# EAGLE schematic space_charge_psu (EAGLE 7.2.0)
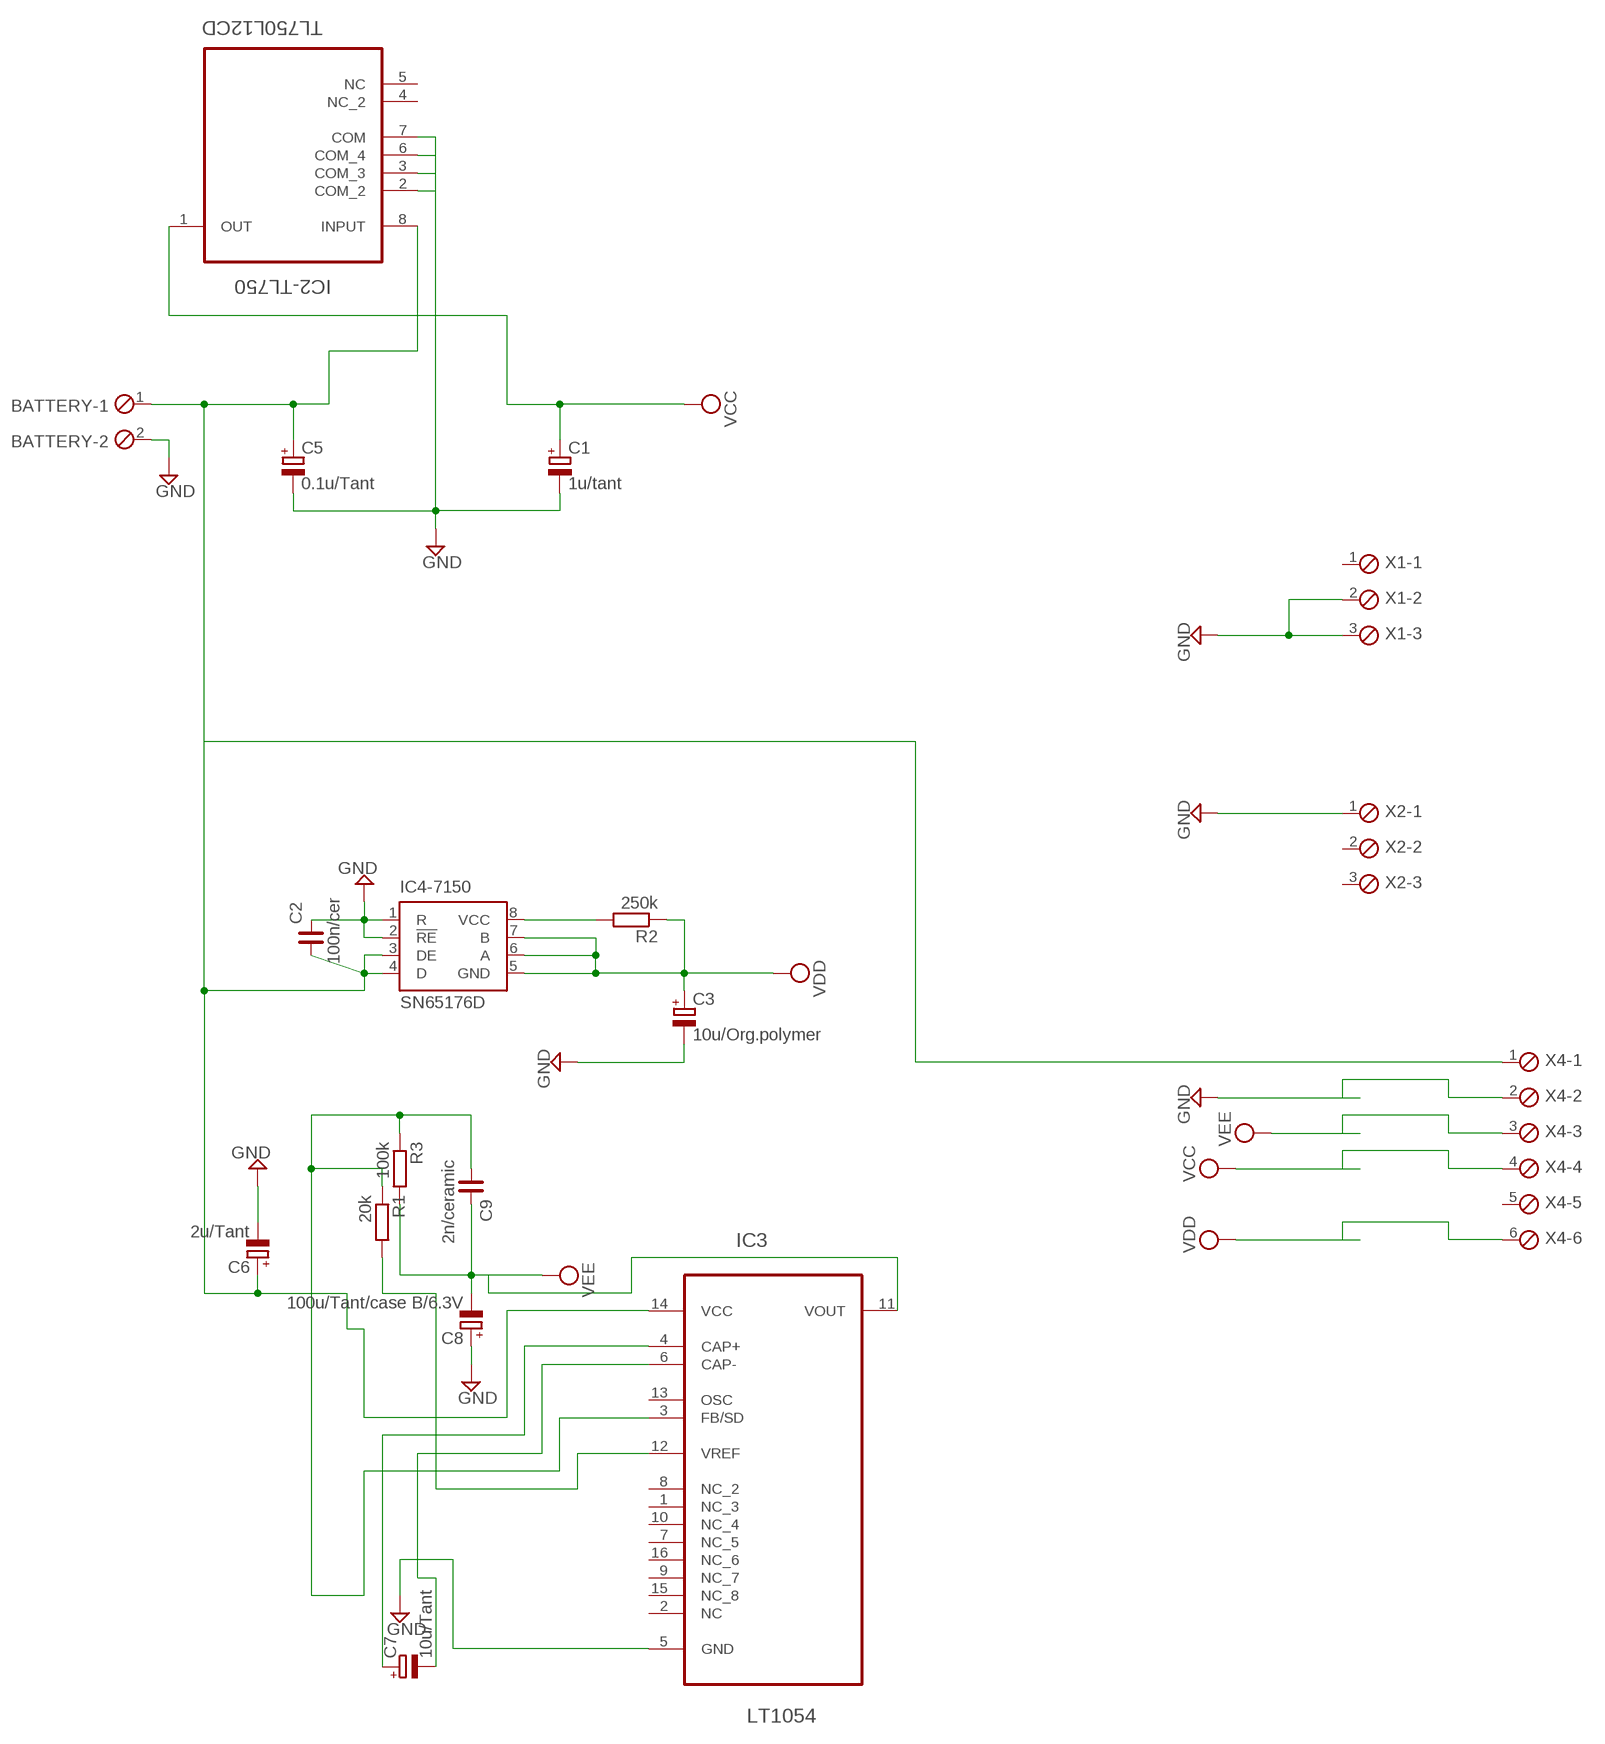
[diagram p0: schematic, sheet 1]

## Parts
BATTERY  MPT2  [2POL254]
C1  1u/tant  CPOL-EUA/3216-18R  [A/3216-18R]
C2  100n/cer  C_1206  [C1206]
C3  10u/Org.polymer  CPOL-EU153CLV-0505  [153CLV-0505]
C5  0.1u/Tant  CPOL-EUA/3216-18R  [A/3216-18R]
C6  2u/Tant  CPOL-EUA/3216-18R  [A/3216-18R]
C7  10u/Tant  CPOL-EUA/3216-18R  [A/3216-18R]
C8  100u/Tant/case B/6.3V  CPOL-EUB/3528-21R  [B/3528-21R]
C9  2n/ceramic  C_1206  [C1206]
IC2-TL750  TL750L12CD  [SOIC127P600X175-8N]
IC3  LT1054  LT1054CDW  [SOIC127P1030X265-16N]
IC4-7150  SN65176D  [SO-08]
R1  20k  R-EU_R1206  [R1206]
R2  250k  R-EU_R1206  [R1206]
R3  100k  R-EU_R1206  [R1206]
X1  MPT3  [3POL254]
X2  MPT3  [3POL254]
X4  MPT6  [6POL254]

## Nets
GND: BATTERY.2 C1.- C2.2 C3.- C5.- C6.- C8.+ IC2-TL750.2(COM_2) IC2-TL750.3(COM_3) IC2-TL750.6(COM_4) IC2-TL750.7(COM) IC3.5(GND) IC4-7150.1(R) IC4-7150.2(!RE) X1.2 X1.3 X2.1 X4.2
N$3: BATTERY.1 C2.1 C5.+ C6.+ IC2-TL750.8(INPUT) IC3.14(VCC) IC4-7150.3(DE) IC4-7150.4(D) X4.1
N$4: IC4-7150.8(VCC) R2.2
N$5: IC3.12(VREF) R1.2
N$6: C7.+ IC3.4(CAP+)
N$7: C7.- IC3.6(CAP-)
N$12: C9.1 IC3.3(FB/SD) R1.1 R3.1
VCC: C1.+ IC2-TL750.1(OUT) X4.4
VDD: C3.+ IC4-7150.5(GND) IC4-7150.6(A) IC4-7150.7(B) R2.1 X4.6
VEE: C8.- C9.2 IC3.11(VOUT) R3.2 X4.3
Unconnected: IC2-TL750.4(NC_2) IC2-TL750.5(NC) IC3.1(NC_3) IC3.2(NC) IC3.7(NC_5) IC3.8(NC_2) IC3.9(NC_7) IC3.10(NC_4) IC3.13(OSC) IC3.15(NC_8) IC3.16(NC_6) X1.1 X2.2 X2.3 X4.5

## Library data of the parts
BATTERY = con-phoenix-254:MPT2: PHOENIX CONNECTOR; OC_FARNELL: unknown; OC_NEWARK: unknown
C1 C3 C5-C8 = rcl:CPOL-EU: POLARIZED CAPACITOR, European symbol
C2 C9 = rc-master-smd:C_: NON-POLARIZED CAP
IC2-TL750 = Texas Instruments_By_element14_Batch_1:TL750L12CD: LOW-DROPOUT VOLTAGE REGULATORS; MPN: TL750L12CD; OC_FARNELL: 1756302; OC_NEWARK: 76C9335; PACKAGE: SOIC-8; SUPPLIER: Texas Instruments
IC3 = Texas Instruments_By_element14_Batch_1:LT1054CDW: Switched Capacitor Voltage converters with regulators; MPN: LT1054CDW; OC_FARNELL: -; OC_NEWARK: 34K7848; PACKAGE: SOIC-16; SUPPLIER: TEXAS INSTRUMENTS
IC4-7150 = texas:SN65176: DIFFERENTIAL BUS TRANSCEIVER Source: http://focus.ti.com .. sn65176b.pdf; MF: TEXAS INSTRUMENTS; MPN: SN65176BD; OC_FARNELL: 9589970; OC_NEWARK: 08F5891
R1-R3 = rcl:R-EU_: RESISTOR, European symbol
X1 X2 = con-phoenix-254:MPT3: PHOENIX CONNECTOR; OC_FARNELL: unknown; OC_NEWARK: unknown
X4 = con-phoenix-254:MPT6: PHOENIX CONNECTOR; OC_FARNELL: unknown; OC_NEWARK: unknown